# Altium project ArduinoMega2560.PrjPcb
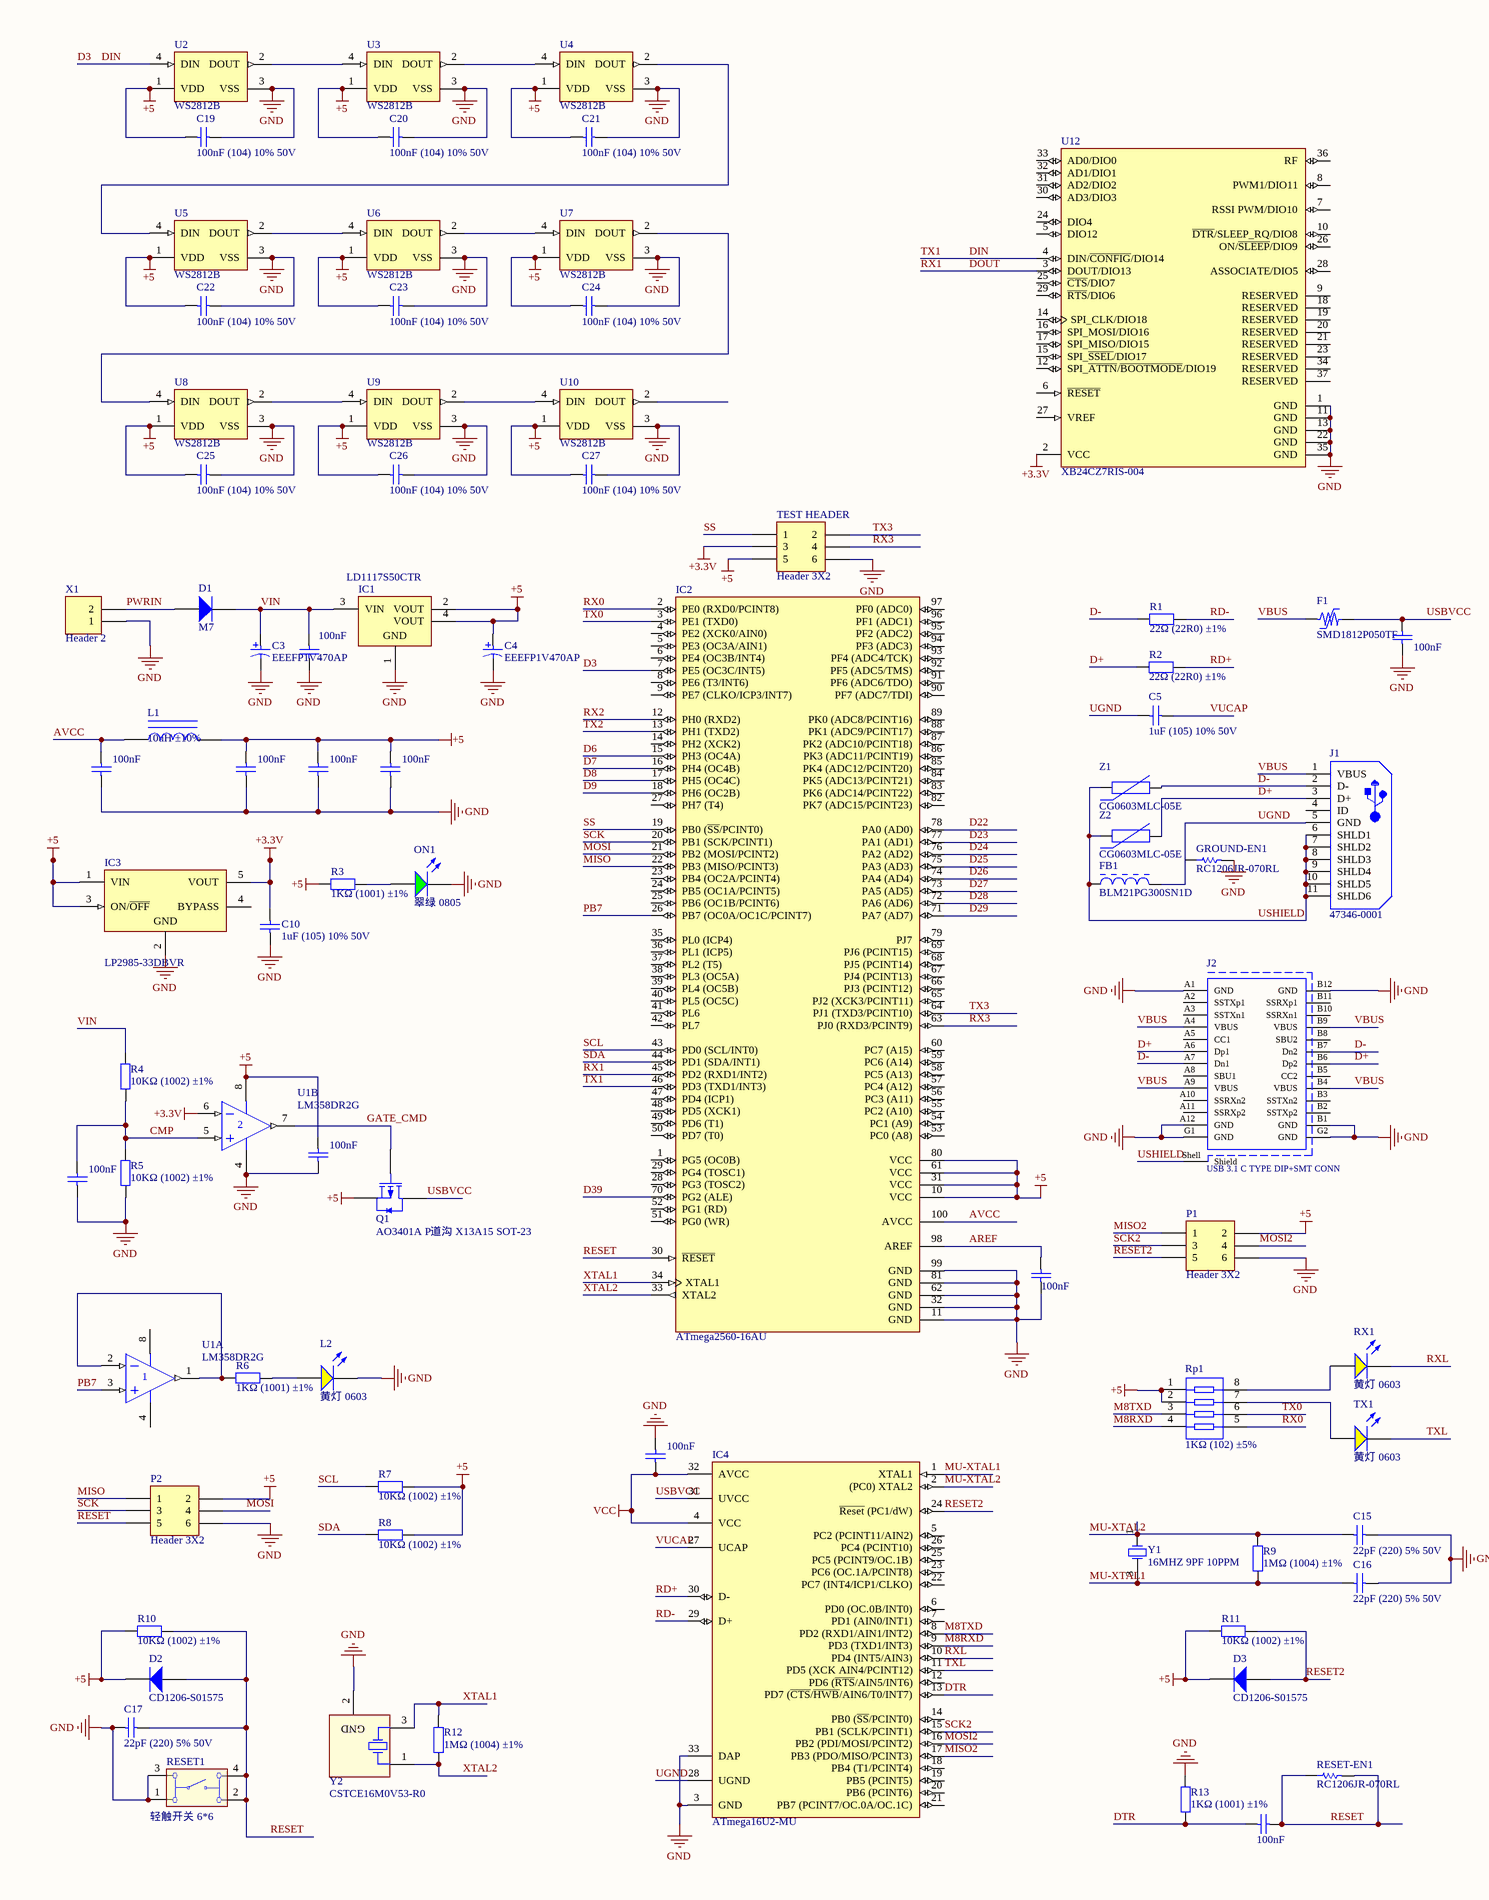
[diagram p0: ArduinoMega2560.SchDoc, left]
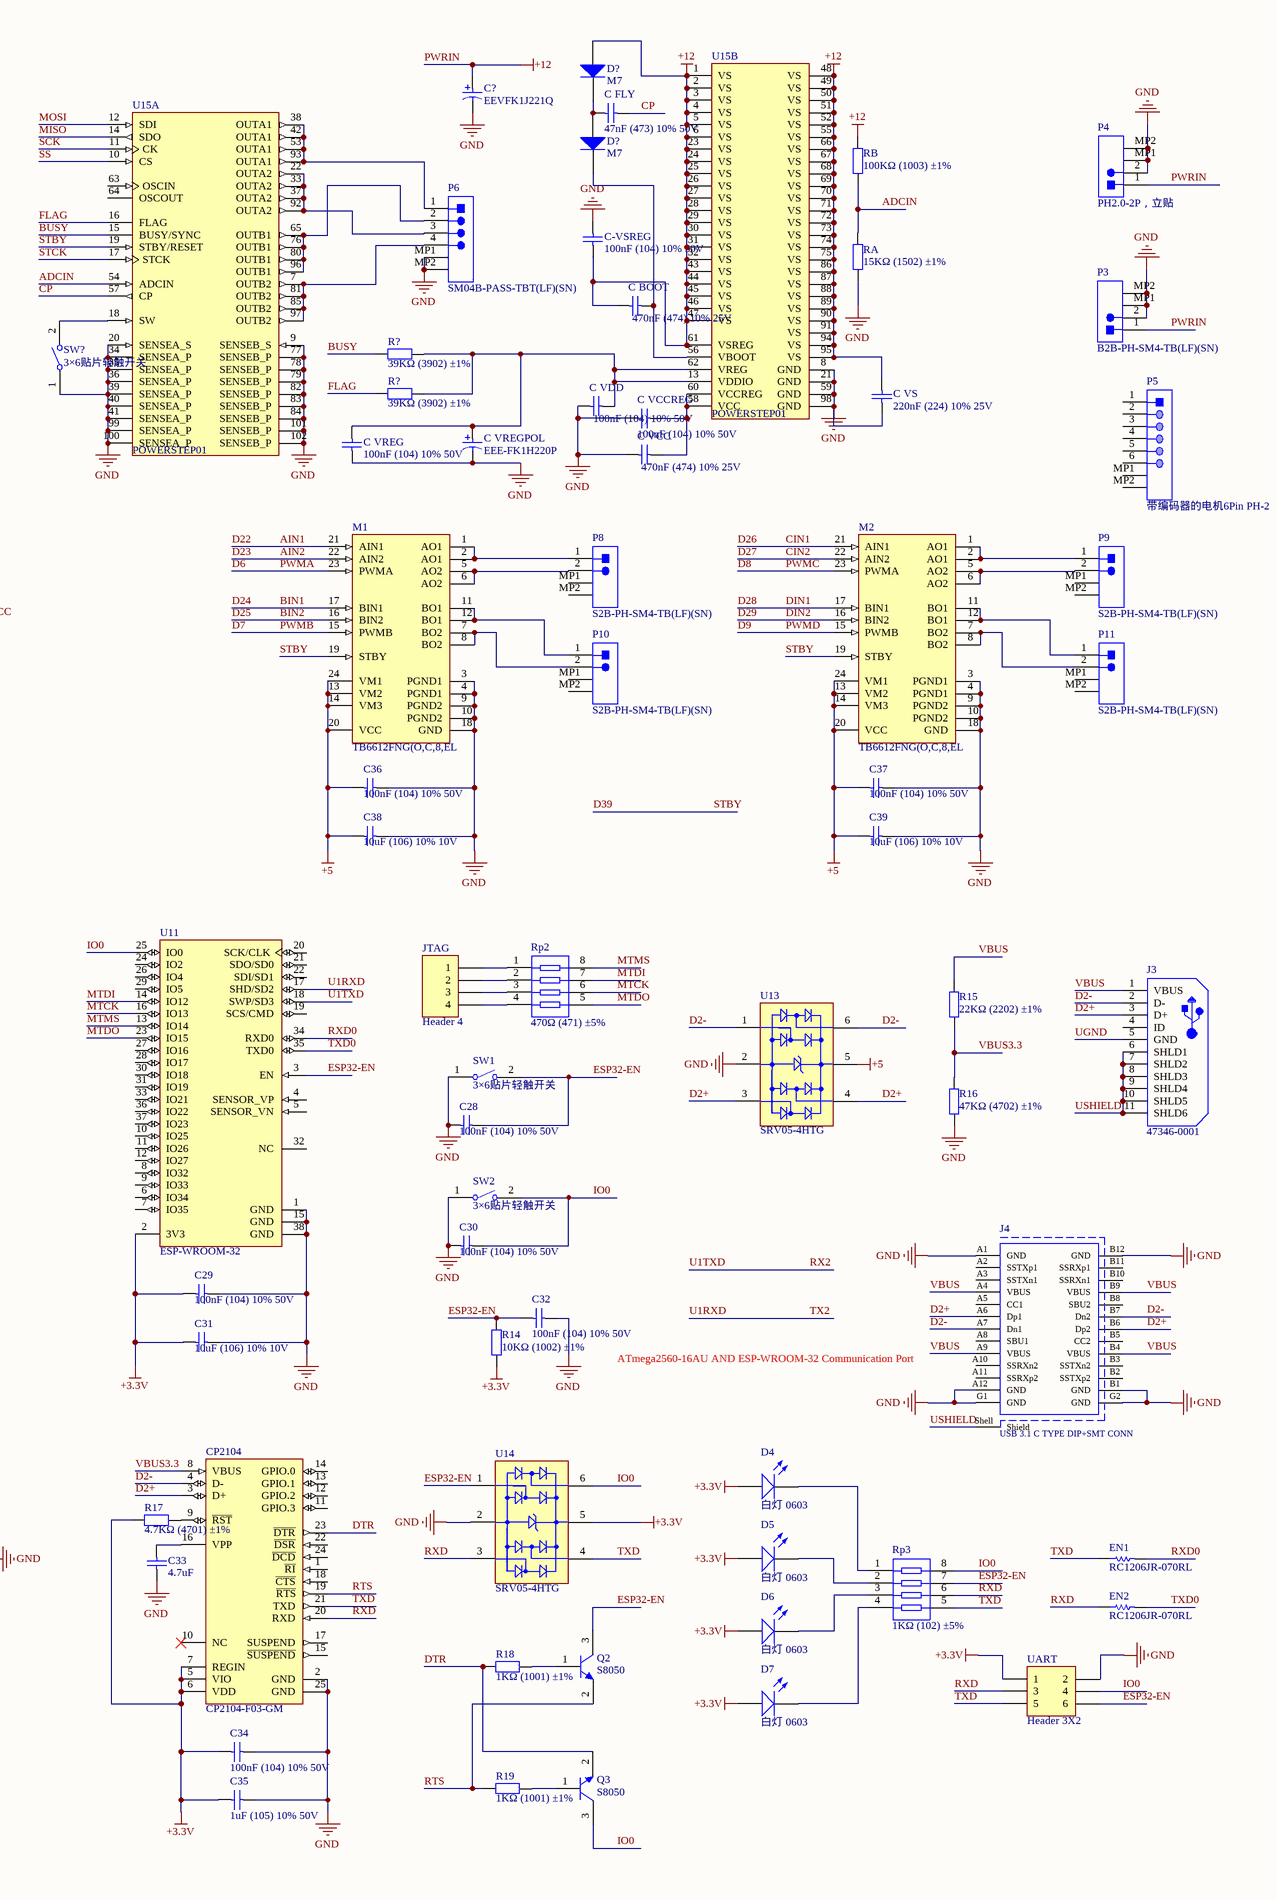
[diagram p1: ArduinoMega2560.SchDoc, right]
1 sheet, 146 parts. Net scope: global (net labels, ports and power ports of the same name join across sheets).
Board file: ArduinoMega2560.PcbDoc

## Sheet ArduinoMega2560.SchDoc
size A2

### Parts
(Parts that share a designator on the sheet are numbered #1, #2 ... from top to bottom, then left to right.)
C1  100nF  [0603_C]
C2  100nF  [0603_C]
C3  EEEFP1V470AP  [PNSC-FP-V-D_V]
C4  EEEFP1V470AP  [PNSC-FP-V-D_V]
C5  1uF (105) 10% 50V  [0603_C]
C6  100nF  [0603_C]
C7  100nF  [0603_C]
C8  100nF  [0603_C]
C9  100nF  [0603_C]
C10  1uF (105) 10% 50V  [0603_C]
C11  100nF  [0603_C]
C12  100nF  [0603_C]
C13  100nF  [0603_C]
C14  100nF  [0603_C]
C15  22pF (220) 5% 50V  [0603_C]
C16  22pF (220) 5% 50V  [0603_C]
C17  22pF (220) 5% 50V  [0603_C]
C18  100nF  [0603_C]
C19  100nF (104) 10% 50V  [0603_C]
C20  100nF (104) 10% 50V  [0603_C]
C21  100nF (104) 10% 50V  [0603_C]
C22  100nF (104) 10% 50V  [0603_C]
C23  100nF (104) 10% 50V  [0603_C]
C24  100nF (104) 10% 50V  [0603_C]
C25  100nF (104) 10% 50V  [0603_C]
C26  100nF (104) 10% 50V  [0603_C]
C27  100nF (104) 10% 50V  [0603_C]
C28  100nF (104) 10% 50V  [0603_C]
C29  100nF (104) 10% 50V  [0603_C]
C30  100nF (104) 10% 50V  [0603_C]
C31  10uF (106) 10% 10V  [0603_C]
C32  100nF (104) 10% 50V  [0603_C]
C33  4.7uF  [0603_C]
C34  100nF (104) 10% 50V  [0603_C]
C35  1uF (105) 10% 50V  [0603_C]
C36  100nF (104) 10% 50V  [0603_C]
C37  100nF (104) 10% 50V  [0603_C]
C38  10uF (106) 10% 10V  [0603_C]
C39  10uF (106) 10% 10V  [0603_C]
C-VSREG  100nF (104) 10% 50V  [0603_C]
C?  EEVFK1J221Q  [PNSC-FK-V-H13_V]
C_BOOT  470nF (474) 10% 25V  [0603_C]
C_FLY  47nF (473) 10% 50V  [0603_C]
C_VCC  470nF (474) 10% 25V  [0603_C]
C_VCCREG  100nF (104) 10% 50V  [0603_C]
C_VDD  100nF (104) 10% 50V  [0603_C]
C_VREG  100nF (104) 10% 50V  [0603_C]
C_VREGPOL  EEE-FK1H220P  [PNSC-EEE-FK1H220P_L]
C_VS  220nF (224) 10% 25V  [0603_C]
CP2104  CP2104-F03-GM  [SLAB-QFN-24-2675x2675TP_M]
D1  M7  [SMA(DO-214AC)_S1]
D2  CD1206-S01575  [BOUR-CD1206-S01575-2_L]
D3  CD1206-S01575  [BOUR-CD1206-S01575-2_L]
D4  白灯 0603  [0603_LED_S1]
D5  白灯 0603  [0603_LED_S1]
D6  白灯 0603  [0603_LED_S1]
D7  白灯 0603  [0603_LED_S1]
D?#1  M7  [SMA(DO-214AC)_S1]
D?#2  M7  [SMA(DO-214AC)_S1]
EN1  RC1206JR-070RL  [RESC3116X65X40ML10T20]
EN2  RC1206JR-070RL  [RESC3116X65X40ML10T20]
F1  SMD1812P050TF  [BOUR-MF-MSMF050-2_V]
FB1  BLM21PG300SN1D  [MURA-BLM21-B40-CHIP-2_V2]
GROUND-EN1  RC1206JR-070RL  [RESC3116X65X40ML10T20]
IC1  LD1117S50CTR  [SOT-223_N]
IC2  ATmega2560-16AU  [100A_M]
IC3  LP2985-33DBVR  [DBV0005A_M]
IC4  ATmega16U2-MU  [32PG_N]
J1  47346-0001  [MOLX-47346-0001-5_V]
J2  USB 3.1 C TYPE DIP+SMT CONN  [632723100011]
J3  47346-0001  [MOLX-47346-0001-5_V]
J4  USB 3.1 C TYPE DIP+SMT CONN  [632723100011]
JTAG  Header 4  [HDR1X4]
L1  10uH ±10%  [0603_L]
L2  黄灯 0603  [0603_LED_S1]
M1  TB6612FNG(O,C,8,EL  [TOSH-SSOP24-P-300-0.65A_M]
M2  TB6612FNG(O,C,8,EL  [TOSH-SSOP24-P-300-0.65A_M]
ON1  翠绿 0805  [0805_LED_S1]
P1  Header 3X2  [HDR2X3]
P2  Header 3X2  [HDR2X3]
P3  B2B-PH-SM4-TB(LF)(SN)  [JST-B2B-PH-SM4-TB-2_V]
P4  PH2.0-2P，立贴  [JST-B2B-PH-SM4-TB-2_V]
P5  带编码器的电机6Pin PH-2  [JST-S6B-PH-SM4-TB(LF)(SN)_V]
P6  SM04B-PASS-TBT(LF)(SN)  [JST-SM04B-PASS-TBT(LF)(SN)_V]
P8  S2B-PH-SM4-TB(LF)(SN)  [JST- S2B-PH-SM4-TB(LF)(SN)-2_V]
P9  S2B-PH-SM4-TB(LF)(SN)  [JST- S2B-PH-SM4-TB(LF)(SN)-2_V]
P10  S2B-PH-SM4-TB(LF)(SN)  [JST- S2B-PH-SM4-TB(LF)(SN)-2_V]
P11  S2B-PH-SM4-TB(LF)(SN)  [JST- S2B-PH-SM4-TB(LF)(SN)-2_V]
Q1  AO3401A P道沟 X13A15 SOT-23  [SOT-23-3L]
Q2  S8050  [ONSC-SOT-23-3-318-08_V]
Q3  S8050  [ONSC-SOT-23-3-318-08_V]
R1  22Ω (22R0) ±1%  [0603_R]
R2  22Ω (22R0) ±1%  [0603_R]
R3  1KΩ (1001) ±1%  [0603_R]
R4  10KΩ (1002) ±1%  [0603_R]
R5  10KΩ (1002) ±1%  [0603_R]
R6  1KΩ (1001) ±1%  [0603_R]
R7  10KΩ (1002) ±1%  [0603_R]
R8  10KΩ (1002) ±1%  [0603_R]
R9  1MΩ (1004) ±1%  [0603_R]
R10  10KΩ (1002) ±1%  [0603_R]
R11  10KΩ (1002) ±1%  [0603_R]
R12  1MΩ (1004) ±1%  [0603_R]
R13  1KΩ (1001) ±1%  [0603_R]
R14  10KΩ (1002) ±1%  [0603_R]
R15  22KΩ (2202) ±1%  [0603_R]
R16  47KΩ (4702) ±1%  [0603_R]
R17  4.7KΩ (4701) ±1%  [0603_R]
R18  1KΩ (1001) ±1%  [0603_R]
R19  1KΩ (1001) ±1%  [0603_R]
R?#1  39KΩ (3902) ±1%  [0603_R]
R?#2  39KΩ (3902) ±1%  [0603_R]
RA  15KΩ (1502) ±1%  [0603_R]
RB  100KΩ (1003) ±1%  [0603_R]
RESET1  轻触开关 6*6  [430152043836]
RESET-EN1  RC1206JR-070RL  [RESC3116X65X40ML10T20]
Rp1  1KΩ (102) ±5%  [0603_Rx4]
Rp2  470Ω (471) ±5%  [0603_Rx4]
Rp3  1KΩ (102) ±5%  [0603_Rx4]
RX1  黄灯 0603  [0603_LED_S1]
SW1  3×6贴片轻触开关  [TECO-FSMSM-2_V]
SW2  3×6贴片轻触开关  [TECO-FSMSM-2_V]
SW?  3×6贴片轻触开关  [TECO-FSMSM-2_V]
TEST_HEADER  Header 3X2  [HDR2X3]
TX1  黄灯 0603  [0603_LED_S1]
U1  LM358DR2G  [SOIC-8_150mil]  (parts A,B of 2)
U2  WS2812B  [ADA-RGB-1655_V]
U3  WS2812B  [ADA-RGB-1655_V]
U4  WS2812B  [ADA-RGB-1655_V]
U5  WS2812B  [ADA-RGB-1655_V]
U6  WS2812B  [ADA-RGB-1655_V]
U7  WS2812B  [ADA-RGB-1655_V]
U8  WS2812B  [ADA-RGB-1655_V]
U9  WS2812B  [ADA-RGB-1655_V]
U10  WS2812B  [ADA-RGB-1655_V]
U11  ESP-WROOM-32  [OLMX-ESP-WROOM-32]
U12  XB24CZ7RIS-004  [DIGI-XB24CZ7RIS-004-Module-37_V]
U13  SRV05-4HTG  [LFUS-SOT23-6_V]
U14  SRV05-4HTG  [LFUS-SOT23-6_V]
U15  POWERSTEP01  [STM-VFQFPN-102_V]  (parts A,B of 2)
UART  Header 3X2  [HDR2X3]
X1  Header 2  [HDR1X2]
Y1  16MHZ 9PF 10PPM  [SMD-3225_4P]
Y2  CSTCE16M0V53-R0  [MURA-CSTCE_V-3_V]
Z1  CG0603MLC-05E  [BOUR-CG0603-2_V]
Z2  CG0603MLC-05E  [BOUR-CG0603-2_V]

### Nets
+3.3V: C10.2 C29.1 C31.1 C34.1 C35.1 CP2104.5(VIO) CP2104.6(VDD) CP2104.7(REGIN) D4.A D5.A D6.A D7.A IC3.5(VOUT) R14.1 R17.2 TEST_HEADER.3 U1.6(IN-) U11.2(3V3) U12.2(VCC) U14.5(VCC) UART.1
+5: C4.1 C7.1 C8.1 C9.1 C11.1 C19.1 C20.1 C21.1 C22.1 C23.1 C24.1 C25.1 C26.1 C27.1 C36.1 C37.1 C38.1 C39.1 D2.2(K) D3.2(K) IC1.2(VOUT) IC1.4(VOUT) IC2.10(VCC) IC2.31(VCC) IC2.61(VCC) IC2.80(VCC) IC3.1(VIN) IC3.3(ON/~{OFF}) L1.2 M1.13(VM2) M1.14(VM3) M1.20(VCC) M1.24(VM1) M2.13(VM2) M2.14(VM3) M2.20(VCC) M2.24(VM1) P1.2 P2.2 Q1.2(S) R3.1 R7.1 R8.1 R10.2 R11.2 Rp1.1 Rp1.2 TEST_HEADER.5 U1.8(V+) U2.1(VDD) U3.1(VDD) U4.1(VDD) U5.1(VDD) U6.1(VDD) U7.1(VDD) U8.1(VDD) U9.1(VDD) U10.1(VDD) U13.5(VCC)
GND: C1.1 C2.2 C3.2 C4.2 C6.2 C7.2 C8.2 C9.2 C10.1 C11.2 C12.2 C13.2 C14.1 C15.1 C16.2 C17.1 C19.2 C20.2 C21.2 C22.2 C23.2 C24.2 C25.2 C26.2 C27.2 C28.1 C29.2 C30.1 C31.2 C32.2 C33.1 C34.2 C35.2 C36.2 C37.2 C38.2 C39.2 C-VSREG.2 C?.2 C_VCC.1 C_VCCREG.1 C_VDD.1 C_VREG.1 C_VREGPOL.2 C_VS.1 CP2104.2(GND) CP2104.25(GND) GROUND-EN1.2 IC1.1(GND) IC2.11(GND) IC2.32(GND) IC2.62(GND) IC2.81(GND) IC2.99(GND) IC3.2(GND) IC4.3(GND) IC4.33(DAP) J2.A1(GND) J2.A12(GND) J2.B1(GND) J2.B12(GND) J2.G1(GND) J2.G2(GND) J4.A1(GND) J4.A12(GND) J4.B1(GND) J4.B12(GND) J4.G1(GND) J4.G2(GND) L2.K M1.3(PGND1) M1.4(PGND1) M1.9(PGND2) M1.10(PGND2) M1.18(GND) M2.3(PGND1) M2.4(PGND1) M2.9(PGND2) M2.10(PGND2) M2.18(GND) ON1.K P1.6 P2.6 P3.2 P3.MP1 P3.MP2 P4.2 P4.MP1 P4.MP2 P6.MP1 P6.MP2 R5.1 R13.1 R16.1 RA.1 RESET1.1 RESET1.3 SW1.1 SW2.1 SW?.1 TEST_HEADER.6 U1.4(V-) U2.3(VSS) U3.3(VSS) U4.3(VSS) U5.3(VSS) U6.3(VSS) U7.3(VSS) U8.3(VSS) U9.3(VSS) U10.3(VSS) U11.1(GND) U11.15(GND) U11.38(GND) U12.1(GND) U12.11(GND) U12.13(GND) U12.22(GND) U12.35(GND) U13.2(GND) U14.2(GND) U15.8(GND) U15.9(SENSEB_S) U15.20(SENSEA_S) U15.21(GND) U15.34(SENSEA_P) U15.35(SENSEA_P) U15.36(SENSEA_P) U15.39(SENSEA_P) U15.40(SENSEA_P) U15.41(SENSEA_P) U15.59(GND) U15.77(SENSEB_P) U15.78(SENSEB_P) U15.79(SENSEB_P) U15.82(SENSEB_P) U15.83(SENSEB_P) U15.84(SENSEB_P) U15.98(GND) U15.99(SENSEA_P) U15.100(SENSEA_P) U15.101(SENSEB_P) U15.102(SENSEB_P) UART.2 X1.1 Y2.2(GND)
PWRIN: C-VSREG.1 C?.1 C_BOOT.1 C_VS.2 D1.1(A) D?#1.1(A) P3.1 P4.1 RB.2 U15.1(VS) U15.2(VS) U15.3(VS) U15.4(VS) U15.5(VS) U15.6(VS) U15.23(VS) U15.24(VS) U15.25(VS) U15.26(VS) U15.27(VS) U15.28(VS) U15.29(VS) U15.30(VS) U15.31(VS) U15.32(VS) U15.43(VS) U15.44(VS) U15.45(VS) U15.46(VS) U15.47(VS) U15.48(VS) U15.49(VS) U15.50(VS) U15.51(VS) U15.52(VS) U15.55(VS) U15.61(VSREG) U15.66(VS) U15.67(VS) U15.68(VS) U15.69(VS) U15.70(VS) U15.71(VS) U15.72(VS) U15.73(VS) U15.74(VS) U15.75(VS) U15.86(VS) U15.87(VS) U15.88(VS) U15.89(VS) U15.90(VS) U15.91(VS) U15.94(VS) U15.95(VS) X1.2  [also labelled +12]
VCC: C14.2 IC4.4(VCC) IC4.32(AVCC)
ADCIN: RA.2 RB.1 U15.54(ADCIN)
AIN1: IC2.78(PA0_(AD0)) M1.21(AIN1)  [also labelled D22]
AIN2: IC2.77(PA1_(AD1)) M1.22(AIN2)  [also labelled D23]
AREF: C13.1 IC2.98(AREF)
AVCC: C6.1 IC2.100(AVCC) L1.1
BIN1: IC2.76(PA2_(AD2)) M1.17(BIN1)  [also labelled D24]
BIN2: IC2.75(PA3_(AD3)) M1.16(BIN2)  [also labelled D25]
BUSY: R?#1.1 U15.15(BUSY/SYNC)
CIN1: IC2.74(PA4_(AD4)) M2.21(AIN1)  [also labelled D26]
CIN2: IC2.73(PA5_(AD5)) M2.22(AIN2)  [also labelled D27]
CMP: C12.1 R4.1 R5.2 U1.5(IN+)
CP: C_FLY.2 U15.57(CP)
D2+: CP2104.3(D+) J3.3(D+) J4.A6(Dp1) J4.B6(Dp2) U13.3(I/O_2) U13.4(I/O_3)
D2-: CP2104.4(D-) J3.2(D-) J4.A7(Dn1) J4.B7(Dn2) U13.1(I/O_1) U13.6(I/O_4)
D3: IC2.7(PE5_(OC3C/INT5)) IC2.46(PD3_(TXD1/INT3)) U2.4(DIN) U12.4(DIN/~{CONFIG}/DIO14)  [also labelled DIN, TX1]
D6: IC2.15(PH3_(OC4A)) M1.23(PWMA)  [also labelled PWMA]
D7: IC2.16(PH4_(OC4B)) M1.15(PWMB)  [also labelled PWMB]
D8: IC2.17(PH5_(OC4C)) M2.23(PWMA)  [also labelled PWMC]
D9: IC2.18(PH6_(OC2B)) M2.15(PWMB)  [also labelled PWMD]
D28: IC2.72(PA6_(AD6)) M2.17(BIN1)  [also labelled DIN1]
D29: IC2.71(PA7_(AD7)) M2.16(BIN2)  [also labelled DIN2]
D39: IC2.70(PG2_(ALE)) M1.19(STBY) M2.19(STBY) U15.19(STBY/RESET)  [also labelled STBY]
D+: J1.3(D+) J2.A6(Dp1) J2.B6(Dp2) R2.1 Z2.2
D-: J1.2(D-) J2.A7(Dn1) J2.B7(Dn2) R1.1 Z1.2
DOUT: IC2.45(PD2_(RXD1/INT2)) U12.3(DOUT/DIO13)  [also labelled RX1]
DTR: C18.1 CP2104.23(~{DTR}) IC4.13(PD7_(~{CTS}/~{HWB}/AIN6/T0/INT7)) Q3.2(E) R13.2 R18.1
ESP32-EN: C28.2 C32.1 Q2.3(C) R14.2 Rp3.7 SW1.2 U11.3(EN) U14.1(I/O_1) UART.6
FLAG: R?#2.1 U15.16(FLAG)
GATE_CMD: Q1.1(G) U1.7(OUT)
IO0: C30.2 Q3.3(C) Rp3.8 SW2.2 U11.25(IO0) U14.6(I/O_4) UART.4
M8RXD: IC4.9(PD3_(TXD1/INT3)) Rp1.4
M8TXD: IC4.8(PD2_(RXD1/AIN1/INT2)) Rp1.3
MISO: IC2.22(PB3_(MISO/PCINT3)) P2.1 U15.14(SDO)
MISO2: IC4.17(PB3_(PDO/MISO/PCINT3)) P1.1
MOSI: IC2.21(PB2_(MOSI/PCINT2)) P2.4 U15.12(SDI)
MOSI2: IC4.16(PB2_(PDI/MOSI/PCINT2)) P1.4
MTCK: Rp2.6 U11.16(IO13)
MTDI: Rp2.7 U11.14(IO12)
MTDO: Rp2.5 U11.23(IO15)
MTMS: Rp2.8 U11.13(IO14)
MU-XTAL1: C16.1 IC4.1(XTAL1) R9.2 Y1.3(OSC2)
MU-XTAL2: C15.2 IC4.2((PC0)_XTAL2) R9.1 Y1.1(OSC1)
PB7: IC2.26(PB7_(OC0A/OC1C/PCINT7)) U1.3(IN+)
RD+: IC4.30(D-) R2.2
RD-: IC4.29(D+) R1.2
RESET: C17.2 C18.2 D2.1(A) IC2.30(~{RESET}) P2.5 R10.1 RESET1.2 RESET1.4 RESET-EN1.1 RESET-EN1.2
RESET2: D3.1(A) IC4.24(~{Reset}_(PC1/dW)) P1.5 R11.1
RTS: CP2104.19(~{RTS}) Q2.2(E) R19.1
RX0: IC2.2(PE0_(RXD0/PCINT8)) Rp1.5
RX2: IC2.12(PH0_(RXD2)) U11.18(SWP/SD3)  [also labelled U1TXD]
RX3: IC2.63(PJ0_(RXD3/PCINT9)) TEST_HEADER.4
RXD: CP2104.20(RXD) EN2.1 Rp3.6 U14.3(I/O_2) UART.3
RXD0: EN1.2 U11.34(RXD0)
RXL: IC4.10(PD4_(INT5/AIN3)) RX1.K
SCK: IC2.20(PB1_(SCK/PCINT1)) P2.3 U15.11(CK)
SCK2: IC4.15(PB1_(SCLK/PCINT1)) P1.3
SCL: IC2.43(PD0_(SCL/INT0)) R7.2
SDA: IC2.44(PD1_(SDA/INT1)) R8.2
SS: IC2.19(PB0_(~{SS}/PCINT0)) TEST_HEADER.1 U15.10(CS)
STCK: U15.17(STCK)
TX0: IC2.3(PE1_(TXD0)) Rp1.6
TX2: IC2.13(PH1_(TXD2)) U11.17(SHD/SD2)  [also labelled U1RXD]
TX3: IC2.64(PJ1_(TXD3/PCINT10)) TEST_HEADER.2
TXD: CP2104.21(TXD) EN1.1 Rp3.5 U14.4(I/O_3) UART.5
TXD0: EN2.2 U11.35(TXD0)
TXL: IC4.11(PD5_(XCK_AIN4/PCINT12)) TX1.K
UGND: C5.2 FB1.2 IC4.28(UGND) J1.5(GND) J3.5(GND)
USBVCC: C1.2 F1.2 IC4.31(UVCC) Q1.3(D)
USHIELD: FB1.1 J1.6(SHLD1) J1.7(SHLD2) J1.8(SHLD3) J1.9(SHLD4) J1.10(SHLD5) J1.11(SHLD6) J2.Shell(Shield) J3.6(SHLD1) J3.7(SHLD2) J3.8(SHLD3) J3.9(SHLD4) J3.10(SHLD5) J3.11(SHLD6) J4.Shell(Shield) Z1.1 Z2.1
VBUS: F1.1 J1.1(VBUS) J2.A4(VBUS) J2.A9(VBUS) J2.B4(VBUS) J2.B9(VBUS) J3.1(VBUS) J4.A4(VBUS) J4.A9(VBUS) J4.B4(VBUS) J4.B9(VBUS) R15.2
VBUS3.3: CP2104.8(VBUS) R15.1 R16.2
VIN: C2.1 C3.1 D1.2(K) IC1.3(VIN) R4.2
VUCAP: C5.1 IC4.27(UCAP)
XTAL1: IC2.34(XTAL1) R12.2 Y2.3(C2)
XTAL2: IC2.33(XTAL2) R12.1 Y2.1(C1)
NetC33_2: C33.2 CP2104.16(VPP)
NetC_BOOT_2: C_BOOT.2 D?#2.2(K) U15.56(VBOOT)
NetC_FLY_1: C_FLY.1 D?#1.2(K) D?#2.1(A)
NetC_VCC_2: C_VCC.2 C_VCCREG.2 U15.58(VCC) U15.60(VCCREG)
NetC_VDD_2: C_VDD.2 C_VREG.2 C_VREGPOL.1 R?#1.2 R?#2.2 U15.13(VDDIO) U15.62(VREG)
NetCP2104_9: CP2104.9(~{RST}) R17.1
NetD4_K: D4.K Rp3.1
NetD5_K: D5.K Rp3.2
NetD6_K: D6.K Rp3.3
NetD7_K: D7.K Rp3.4
NetJTAG_1: JTAG.1 Rp2.1
NetJTAG_2: JTAG.2 Rp2.2
NetJTAG_3: JTAG.3 Rp2.3
NetJTAG_4: JTAG.4 Rp2.4
NetL2_A: L2.A R6.2
NetM1_1: M1.1(AO1) M1.2(AO1) P8.1
NetM1_5: M1.5(AO2) M1.6(AO2) P8.2
NetM1_7: M1.7(BO2) M1.8(BO2) P10.2
NetM1_11: M1.11(BO1) M1.12(BO1) P10.1
NetM2_1: M2.1(AO1) M2.2(AO1) P9.1
NetM2_5: M2.5(AO2) M2.6(AO2) P9.2
NetM2_7: M2.7(BO2) M2.8(BO2) P11.2
NetM2_11: M2.11(BO1) M2.12(BO1) P11.1
NetON1_A: ON1.A R3.2
NetP6_1: P6.1 U15.38(OUTA1) U15.42(OUTA1) U15.53(OUTA1) U15.93(OUTA1)
NetP6_2: P6.2 U15.65(OUTB1) U15.76(OUTB1) U15.80(OUTB1) U15.96(OUTB1)
NetP6_3: P6.3 U15.22(OUTA2) U15.33(OUTA2) U15.37(OUTA2) U15.92(OUTA2)
NetP6_4: P6.4 U15.7(OUTB2) U15.81(OUTB2) U15.85(OUTB2) U15.97(OUTB2)
NetQ2_1: Q2.1(B) R18.2
NetQ3_1: Q3.1(B) R19.2
NetR6_1: R6.1 U1.1(OUT) U1.2(IN-)
NetRp1_7: Rp1.7 TX1.A
NetRp1_8: Rp1.8 RX1.A
NetSW?_2: SW?.2 U15.18(SW)
NetU2_2: U2.2(DOUT) U3.4(DIN)
NetU3_2: U3.2(DOUT) U4.4(DIN)
NetU4_2: U4.2(DOUT) U5.4(DIN)
NetU5_2: U5.2(DOUT) U6.4(DIN)
NetU6_2: U6.2(DOUT) U7.4(DIN)
NetU7_2: U7.2(DOUT) U8.4(DIN)
NetU8_2: U8.2(DOUT) U9.4(DIN)
NetU9_2: U9.2(DOUT) U10.4(DIN)

Not connected (* = marked no-connect by the designer): CP2104 1(~{RI}) 10(NC)* 11(GPIO.3) 12(GPIO.2) 13(GPIO.1) 14(GPIO.0) 15(~{SUSPEND}) 17(SUSPEND) 18(~{CTS}) 22(~{DSR}) 24(~{DCD}); GROUND-EN1 1; IC2 1(PG5_(OC0B)) 4(PE2_(XCK0/AIN0)) 5(PE3_(OC3A/AIN1)) 6(PE4_(OC3B/INT4)) 8(PE6_(T3/INT6)) 9(PE7_(CLKO/ICP3/INT7)) 14(PH2_(XCK2)) 23(PB4_(OC2A/PCINT4)) 24(PB5_(OC1A/PCINT5)) 25(PB6_(OC1B/PCINT6)) 27(PH7_(T4)) 28(PG3_(TOSC2)) 29(PG4_(TOSC1)) 35(PL0_(ICP4)) 36(PL1_(ICP5)) 37(PL2_(T5)) 38(PL3_(OC5A)) 39(PL4_(OC5B)) 40(PL5_(OC5C)) 41(PL6) 42(PL7) 47(PD4_(ICP1)) 48(PD5_(XCK1)) 49(PD6_(T1)) 50(PD7_(T0)) 51(PG0_(WR)) 52(PG1_(RD)) 53(PC0_(A8)) 54(PC1_(A9)) 55(PC2_(A10)) 56(PC3_(A11)) 57(PC4_(A12)) 58(PC5_(A13)) 59(PC6_(A14)) 60(PC7_(A15)) 65(PJ2_(XCK3/PCINT11)) 66(PJ3_(PCINT12)) 67(PJ4_(PCINT13)) 68(PJ5_(PCINT14)) 69(PJ6_(PCINT15)) 79(PJ7) 82(PK7_(ADC15/PCINT23)) 83(PK6_(ADC14/PCINT22)) 84(PK5_(ADC13/PCINT21)) 85(PK4_(ADC12/PCINT20)) 86(PK3_(ADC11/PCINT19)) 87(PK2_(ADC10/PCINT18)) 88(PK1_(ADC9/PCINT17)) 89(PK0_(ADC8/PCINT16)) 90(PF7_(ADC7/TDI)) 91(PF6_(ADC6/TDO)) 92(PF5_(ADC5/TMS)) 93(PF4_(ADC4/TCK)) 94(PF3_(ADC3)) 95(PF2_(ADC2)) 96(PF1_(ADC1)) 97(PF0_(ADC0)); IC3 4(BYPASS); IC4 5(PC2_(PCINT11/AIN2)) 6(PD0_(OC.0B/INT0)) 7(PD1_(AIN0/INT1)) 12(PD6_(~{RTS}/AIN5/INT6)) 14(PB0_(~{SS}/PCINT0)) 18(PB4_(T1/PCINT4)) 19(PB5_(PCINT5)) 20(PB6_(PCINT6)) 21(PB7_(PCINT7/OC.0A/OC.1C)) 22(PC7_(INT4/ICP1/CLKO)) 23(PC6_(OC.1A/PCINT8)) 25(PC5_(PCINT9/OC.1B)) 26(PC4_(PCINT10)); J1 4(ID); J2 A2(SSTXp1) A3(SSTXn1) A5(CC1) A8(SBU1) A10(SSRXn2) A11(SSRXp2) B2(SSTXp2) B3(SSTXn2) B5(CC2) B8(SBU2) B10(SSRXn1) B11(SSRXp1); J3 4(ID); J4 A2(SSTXp1) A3(SSTXn1) A5(CC1) A8(SBU1) A10(SSRXn2) A11(SSRXp2) B2(SSTXp2) B3(SSTXn2) B5(CC2) B8(SBU2) B10(SSRXn1) B11(SSRXp1); P5 1 2 3 4 5 6 MP1 MP2; P8 MP1 MP2; P9 MP1 MP2; P10 MP1 MP2; P11 MP1 MP2; U10 2(DOUT); U11 4(SENSOR_VP) 5(SENSOR_VN) 6(IO34) 7(IO35) 8(IO32) 9(IO33) 10(IO25) 11(IO26) 12(IO27) 19(SCS/CMD) 20(SCK/CLK) 21(SDO/SD0) 22(SDI/SD1) 24(IO2) 26(IO4) 27(IO16) 28(IO17) 29(IO5) 30(IO18) 31(IO19) 32(NC) 33(IO21) 36(IO22) 37(IO23); U12 5(DIO12) 6(~{RESET}) 7(RSSI_PWM/DIO10) 8(PWM1/DIO11) 9(RESERVED) 10(~{DTR}/SLEEP_RQ/DIO8) 12(SPI_~{ATTN}/~{BOOTMODE}/DIO19) 14(SPI_CLK/DIO18) 15(SPI_~{SSEL}/DIO17) 16(SPI_MOSI/DIO16) 17(SPI_MISO/DIO15) 18(RESERVED) 19(RESERVED) 20(RESERVED) 21(RESERVED) 23(RESERVED) 24(DIO4) 25(~{CTS}/DIO7) 26(ON/~{SLEEP}/DIO9) 27(VREF) 28(ASSOCIATE/DIO5) 29(~{RTS}/DIO6) 30(AD3/DIO3) 31(AD2/DIO2) 32(AD1/DIO1) 33(AD0/DIO0) 34(RESERVED) 36(RF) 37(RESERVED); U15 63(OSCIN) 64(OSCOUT)

### Notes on the sheet
- ATmega2560-16AU AND ESP-WROOM-32 Communication Port

### Library data of the parts
C1 C2 C6-C9 C11-C14 C18-C30 C32 C34 C36 C37 C-VSREG C_VCCREG C_VDD C_VREG = 0603 100nF (104) 10% 50V: 贴片电容; ComponentLink1Description: 供应商链接; ComponentLink1URL: http://www.szlcsc.com/product/details_15331.html; Package: 0603; Supplier: LC; SuppliersPartNumber: C14663
C3 C4 = CMP-2000-06216-1: Aluminum Electrolytic Capacitor, 47 uF, +/- 20%, 35 V, 2-Pin SMD (Size Code D), -55 to 105 degC, RoHS, Tape and Reel; Manufacturer: Panasonic; Lifetime@Temperature: 2000Hrs@105°C; Capacitance: 47µF; Type: Can; Rated Voltage: 35V; Ripple Current: 300mA; ESR (Equivalent Series Resistance): 0.26O; Package Reference: FP-V-D; Package Description: 2-Pin Electrolytic Aluminum Capacitor, Body 6.6 x 6.6 mm; Datasheet URL: http://industrial.panasonic.com/cdbs/www-data/pdf/RDE0000/ABA0000C1184.pdf; Series: FP; Operating Temp Range: -55to+105°C; Operating Temp-Max: 105°C; Datasheet Version: 03/2016; Manufacturer URL: http://www.panasonic.com/; Package URL: http://industrial.panasonic.com/cdbs/www-data/pdf/RDE0000/DME0000COL48.pdf; Case Size/Dimension: Ø6.3x5.8mm; Mounting Technology: SurfaceMount
C5 C10 C35 = 0603 1uF (105) 10% 50V: 贴片电容; ComponentLink1Description: 供应商链接; ComponentLink1URL: http://www.szlcsc.com/product/details_16531.html; Package: 0603; Supplier: LC; SuppliersPartNumber: C15849
C15-C17 = 0603 22pF (220) 5% 50V: 贴片电容; ComponentLink1Description: 供应商链接; ComponentLink1URL: http://www.szlcsc.com/product/details_2005.html; Package: 0603; Supplier: LC; SuppliersPartNumber: C1653
C31 C38 C39 = 0603 10uF (106) 10% 10V: 贴片电容; ComponentLink1Description: 供应商链接; ComponentLink1URL: http://www.szlcsc.com/product/details_20411.html; Package: 0603; Supplier: LC; SuppliersPartNumber: C19702
C33 = 0603 4.7uF (475) 10% 16V: 贴片电容; ComponentLink1Description: 供应商链接; ComponentLink1URL: http://www.szlcsc.com/product/details_20375.html; Package: 0603; Supplier: LC; SuppliersPartNumber: C19666
C? = CMP-2000-06222-1: Aluminum Electrolytic Capacitor, 220 uF, +/- 20%, 63 V, 2-Pin SMD (Size Code H13), -55 to 105 degC, RoHS, Tape and Reel; Manufacturer: Panasonic; Impedance: 0.16ohm; Life Time @ Temperature: 2000hours@105°C; Product Range: PANASONIC-?????FK; Voltage Rating: 63V; External Length / Height: 13.5mm; Ripple Current Temperature: 105°C; Ripple Current Frequency: 100kHz; Ripple Current AC: 800mA; Power Factor: 0.08; Power Factor Frequency: 120Hz; AE Capacitor Case: RadialCan-SMD; Capacitance: 220µF; Operating Lifetime: 2000h; SVHC: NoSVHC(16-Dec-2013); Diameter: 12.5mm; Package Description: 2-Pin Electrolytic Aluminum Capacitor, Body 13.5 x 13.5 mm; Height: 13.5mm; Package URL: http://industrial.panasonic.com/cdbs/www-data/pdf/RDE0000/DME0000COL48.pdf; Lifetime @ Temperature: 2000hours@105°C; Series: FK; Mounting Technology: SurfaceMount; Datasheet Version: 03/2016; Package / Case: H13; Voltage Rating V DC: 63V; Capacitance Tolerance ±: ±20%; Tolerance +: 20%; Capacitance Tolerance: ±20%; Package Reference: FK-V-H13; Datasheet URL: https://industrial.panasonic.com/cdbs/www-data/pdf/RDE0000/ABA0000C1181.pdf; Operating Temperature Range: -55°Cto+105°C; Manufacturer URL: http://www.panasonic.com/; Operating Temperature Min: -55°C; Capacitor Terminals: SMD; Packaging: CutTape; Operating Temperature Max: 105°C; Tolerance -: 20%; Operating life Time: 2000h; Capacitor Case Style: SMD
C_BOOT C_VCC = 0603 470nF (474) 10% 25V: 贴片电容; ComponentLink1Description: 供应商链接; ComponentLink1URL: http://www.szlcsc.com/product/details_1975.html; Package: 0603; Supplier: LC; SuppliersPartNumber: C1623
C_FLY = 0603 47nF (473) 10% 50V: 贴片电容; ComponentLink1Description: 供应商链接; ComponentLink1URL: http://www.szlcsc.com/product/details_1974.html; Package: 0603; Supplier: LC; SuppliersPartNumber: C1622
C_VREGPOL = CMP-2000-06209-1: Cap Aluminum Lytic, 22 uF, +/- 20%, 6.3 to 100 V, -55 to 105 degC, 2-Pin SMD, RoHS, Tape and Reel; Manufacturer: Panasonic; Capacitance: 22µF; Rated Voltage: 50V; Lifetime@Temperature: 2000Hrs@105°C; Ripple Current: 165mA; Impedance: 0.88O; Operating Temp Range: -55to+105°C; Package Reference: EEE-FK1H220P; Case Size/Dimension: Ø6.3x5.8mm; Manufacturer URL: http://www.panasonic.com/; Datasheet URL: http://www.mouser.com/ds/2/315/ABA0000CE120-68386.pdf; Mounting Technology: SurfaceMount; Datasheet Version: 03/2014; Package Description: 2-Pin Aluminum Electrolytic Capacitor, Base 6.6 x 6.6 mm, Height 6.10 mm; Operating Temp-Max: 105°C; Series: FK; Type: Can
C_VS = 0603 220nF (224) 10% 25V: 贴片电容; ComponentLink1Description: 供应商链接; ComponentLink1URL: http://www.szlcsc.com/product/details_21832.html; Package: 0603; Supplier: LC; SuppliersPartNumber: C21120
CP2104 = CMP-0511-00004-1: Single-Chip USB to UART Bridge, 4 Dig I/O Pins, Internal Oscillator, 1024 Bytes EEPROM, -40 to 85 degC, 24-pin QFN; Manufacturer: Silicon Labs; Sub-Family: USB Bridges; Internal Oscillator: TRUE; Mounting Technology: Surface Mount; ComponentLink3URL: http://www.silabs.com/Support%20Documents/TechnicalDocs/C8051F93x-92x.pdf; DatasheetVersion: Rev. 1.0; ComponentLink1URL: http://www.silabs.com/; Code_IPC: J-STD-020; ComponentLink2URL: http://www.silabs.com/Support%20Documents/TechnicalDocs/cp2104.pdf; Code_JEDEC: MO-220; PackageReference: QFN-24; ComponentLink3Description: Package Specification; PartNumber: CP2104-F03-GM; ComponentLink1Description: Manufacturer URL; ComponentLink2Description: Datasheet; EEPROM: 1024 Bytes; PackageDescription: 24-Pin Quad-Flat No-Leads Package, Body 4 x 4 mm, Pitch 0.5 mm
D1 D?#1 D?#2 = SMA(DO-214AC) M7: 二极管; Notepad: 1N4007 4007 编号C2464 已经停售, 使用新物料编号C95872; ComponentLink1Description: 供应商链接; ComponentLink1URL: http://www.szlcsc.com/product/details_2841.html; Package: SMA(DO-214AC); Supplier: LC; SuppliersPartNumber: C95872
D2 D3 = CMP-0583-00001-2: 75 V Small Signal Switching Diode, 150 mA, 2.5 uA, 1026 Molded Package, RoHS, Tape and Reel; Manufacturer: Bourns; Reverse Voltage: 75 V; Average Forward Current: 150 mA; Reverse Current (Max.): 2.5 uA; Capacitance Between Terminals (Max.): 3 pF; Reverse Recovery Time (Max.): 4 nS; Forward Voltage (Max.): 1.00 V; Packing: Tape and Reel; Mounting Technology: Surface Mount; DatasheetVersion: Rev. 06/11; ComponentLink2URL: http://www.bourns.com/data/global/pdfs/CD1206_S01575.pdf; PackageReference: CD1206-S01575-2; RoHS: TRUE; ComponentLink1URL: http://www.bourns.com/; ComponentLink1Description: Manufacturer URL; ComponentLink3Description: Package Specification; ComponentLink3URL: http://www.bourns.com/data/global/pdfs/CD1206_S01575.pdf; ComponentLink2Description: Datasheet; PackageDescription: 2-Pin SMD, Body 3.2 x 1.5 mm; PartNumber: CD1206-S01575
D4-D7 = 0603 白灯: 发光二极管; ComponentLink1Description: 供应商链接; ComponentLink1URL: http://www.szlcsc.com/product/details_2663.html; Package: 0603; Supplier: LC; SuppliersPartNumber: C2290
EN1 EN2 GROUND-EN1 RESET-EN1 = CMP-2100-03681-1: Chip Resistor, 0 Ohm, +/- 5%, -55 to 155 degC, 1206 (3216 Metric), RoHS, Tape and Reel; Manufacturer: Yageo; Max Power Dissipation: 250mW; Resistance: 0mOhm; Voltage Rating: 200V; Temperature Coefficient: 200ppm/degreesC; Case Code (Imperial): 1206; Lead Free: LeadFree; Package Quantity: 5000; Radiation Hardening: No; Tolerance: 5%; Length: 3.1mm; Termination: SMD/SMT; Contact Plating: Tin; Military Standard: Not; Manufacturer URL: http://www.yageo.com/; Datasheet URL: http://www.yageo.com/documents/recent/PYu-RC_Group_51_RoHS_L_5.pdf; Height: 0.026inch; RoHSCompliant: true; Min Operating Temperature: -55degC; REACH SVHC: Unknown; Max Operating Temperature: 155degC; Depth: 1.6mm; Packaging: TapeandReel; Package Reference: 1206.0; Number of Terminations: 2; Case/Package: 1206; Composition: CarbonFilm; Case Code (Metric): 3216; Datasheet Version: Rev. 5, 10/2016; Power Rating: 250mW; Package Description: 2-Pin Surface Mount Device, Body 3.1 x 1.6 mm; Width: 0.063inch
F1 = CMP-2100-03653-1: PTC Resettable Fuse, 15 V, 500 mA, -40 to 85 degC, 2-Pin SMD, RoHS, Tape and Reel; Manufacturer: Bourns; Voltage Rating (DC): 15V; Max Current Rating: 100A; Power Dissipation: 800mW; Resistance: 150mOhm; Width: 3.41mm; Package Quantity: 2000; Voltage Rating: 15V; RoHSCompliant: true; Contact Plating: Gold; REACH SVHC: NoSVHC; Datasheet URL: http://www.bourns.com/docs/Product-Datasheets/mfmsmf.pdf; Lead Free: LeadFree; Height: 0.85mm; Min Operating Temperature: -40degC; Case Code (Metric): 4532; Number of Terminals: 2; Case Code (Imperial): 1812; Case/Package: 1812; Current Rating: 100A; Length: 4.73mm; Max Operating Temperature: 85degC; Package Reference: MF-MSMF050-2; Radiation Hardening: No; Datasheet Version: Rev. AG, 08/2016; Packaging: TapeandReel; Termination: SMD/SMT; Supply Voltage: 15V; Manufacturer URL: http://www.bourns.com/; Mount: SurfaceMount; Package Description: 2-Pin Surface Mount Device, Body 4.55 x 3.24 mm
FB1 = CMP-0686-00620-2: Chip Ferrite Bead for Power Lines, 30 Ohm, 4000 mA, -55 to 125 degC, 2 x 1.25 x 1.05 mm SMD, Tape and Reel; Manufacturer: Murata; DC Resistance: 0.014 Ohm Max.; Rated Current: 4000 mA; Impedance (at 100 MHz): 30 Ohm Typ.; ComponentLink3Description: Package Specification; Packing: Tape and Reel; ComponentLink3URL: http://www.murata.com/products/catalog/pdf/c31e.pdf; PackageDescription: 2-Pin Chip, Body 2 x 1.25 mm; DatasheetVersion: 08/2013; ComponentLink2Description: Datasheet; ComponentLink1Description: Manufacturer URL; PartNumber: BLM21PG300SN1D; PackageReference: BLM21_H1050-2; Mounting Technology: Surface Mount; ComponentLink1URL: http://www.murata.com/; Operating Temperature Range: -55 to 125 degC; ComponentLink2URL: http://www.murata.com/products/catalog/pdf/c31e.pdf
IC1 = CMP-0244-00311-1: Low-dropout linear regulator 5V -LM1117IMPX-5.0 / Fixed Low Drop Positive Voltage Regulator, 5V, 4-Pin SOT-223, Tape and Reel; PackageReference: SOT-223; PackageVersion: 2010; ComponentLink2URL: http://www.st.com/internet/com/TECHNICAL_RESOURCES/TECHNICAL_LITERATURE/DATASHEET/CD00000544.pdf; ComponentLink1URL: http://www.st.com; ComponentLink2Description: Datasheet; DatasheetVersion: 1/11/2011; ComponentLink1Description: Manufacturer URL; PackageDescription: 4-Pin SOT-223 Package, 6.5 x 3.5 mm Body, 2.3 mm Pitch, 7 mm Lead Span
IC2 = CMP-0095-00210-2: 8-bit AVR Microcontroller, 4.5-5.5V, 16MHz, 256KB Flash, 4KB EEPROM, 8KB SRAM, 86 GPIO pins, 100-pin TQFP, Industrial Grade (-40°C to 85°C), Pb-Free; PackageDescription: 100-Pin Thin Profile Plastic Quad Flat Pack (TQFP), 14 x 14 x 1.0 mm Body, 0.5 mm Pitch; ComponentLink1Description: Manufacturer URL; ComponentLink3URL: http://www.atmel.com/dyn/resources/prod_documents/2549S.pdf; RevisionNote: DatasheetVersion & PackageVersion updated. URLs added.; DatasheetVersion: revN, May-2011; ComponentLink2Description: ATmega640/1280/1281/2560/2561 Datasheet; PackageReference: 100A; PackageVersion: revD, Oct-2010; Code_JEDEC: MS-026-AED; ComponentLink1URL: http://www.atmel.com/; ComponentLink2URL: http://www.atmel.com/dyn/resources/prod_documents/doc2549.pdf; ComponentLink3Description: ATmega640/1280/1281/2560/2561 Summary
IC3 = CMP-0758-00080-2: Single Output Low Noise LDO, 150 mA, Fixed 3.3 V Output, 1.5% Tolerance, 2.2 to 16 V Input, Low IQ, 5-Pin SOT-23 (DBV), -40 to 125 degC, Green (RoHS & no Sb/Br), Tape and Reel; Manufacturer: Texas Instruments; Vdo (Typ) (mV): 280; Accuracy (%): 1.5; Output Options: Fixed Output; Fixed Output Options (V): 3.3; Iout (Max) (A): 0.15; Iq (Typ) (mA): 0.85; ComponentLink3Description: Package Specification; Packing: Tape and Reel; ComponentLink3URL: http://www.ti.com/litv/pdf/mpds018j; Vin (V): 2.2 to 16; Mounting Technology: Surface Mount; ComponentLink1URL: http://www.ti.com/; PartNumber: LP2985-33DBVR; PackageReference: DBV0005A; ComponentLink2URL: http://www.ti.com/lit/ds/symlink/lp2985-50.pdf; RoHS: TRUE; ComponentLink2Description: Datasheet; PackageVersion: 4073253-4/L; Operating Temperature Range (degC): -40 to 125; DatasheetVersion: SLVS522N; ComponentLink1Description: Manufacturer URL; PackageDescription: 5-Pin Plastic Small Outline, Body 2.9 x 1.6 mm, Pitch 0.95 mm
IC4 = CMP-0095-00115-3: 8-bit AVR Microcontroller, 2.7-5.5V, 16KB Flash, 512 Bytes EEPROM, 512 Bytes SRAM, 32-pin VQFN, Industrial Grade (-40°C to 85°C); ComponentLink1Description: Manufacturer URL; RevisionNote: Schematic symbol corrected; ComponentLink3URL: http://www.atmel.com/dyn/resources/prod_documents/7799S.pdf; ComponentLink2URL: http://www.atmel.com/dyn/resources/prod_documents/doc7799.pdf; PackageReference: 32PG; DatasheetVersion: revD, Nov-2010; PartNumber: ATmega16U2-MU; PackageVersion: revA, Oct-2008; Code_JEDEC: MO-220WHHD-2; PackageDescription: 32-Pin Quad Flat No-Lead (QFN) Sawn,  5 x 5 x 1.0 mm Body, Pitch 0.50 mm, 3.60mm Exposed Pad; ComponentLink2Description: ATmega8U2/16U2/32U2 Datasheet; ComponentLink1URL: http://www.atmel.com/; ComponentLink3Description: ATmega8U2/16U2/32U2 Summary
J1 J3 = CMP-2000-05246-1: Micro-USB B Receptacle with Flange, -30 to 85 degC, 5-Pin SMD, RoHS, Tape and Reel; Manufacturer: Molex; Number of Contacts: 5; Body Orientation: RightAngle; Maximum Voltage Rating: 30VAC; Pitch: 0.65mm; Maximum Current Rating: 1.8/ContactA; Number of Ports: 1; Gender: RCP; Operating Temperature: -30to85C; Part No: 47346-0001; Color: Black; Termination Method: Solder; Contact Plating: GoldOverPalladiumNickelOverNickel; Dimension: 7.8x5.43x2.94mm; Number of Terminals: 5; Datasheet Version: Dec-13; Datasheet URL: https://datasheet.ciiva.com/30075/304740473460001-io-nectors-30075527.pdf; Contact Material: CopperAlloy; RoHS: Yes; Housing Material: LiquidCrystalPolymer; Manufacturer URL: http://www.molex.com/; Packaging: EmbossedTapeandReel; Mounting: SurfaceMount; Type: MicroUSBTypeB
J2 J4 = CMP-1502-03213-1: USB 3.1 Type C Receptacle WR-COM, Horizontal, SMT / THT; Manufacturer: Wurth Elektronik; Working Voltage: 20VDC; Rated Current: 5A; Contact Resistance: 30mOhm; Operating Temperature: -40to105degC; Publisher: WurthElektronik; Gender: Receptacle; Part Number: 632723100011; Mounting Technology: SMT/THT; Datasheet URL: https://katalog.we-online.de/em/datasheet/632723x00011%282%29.pdf; Connector Type: USB3.1TypeC; Manufacturer URL: https://item.szlcsc.com/292999.html; Orientation: Horizontal; Package Reference: 632723100011; Packaging: TapeandReel
JTAG = Header 4: Header, 4-Pin; LatestRevisionDate: 17-Jul-2002; LatestRevisionNote: Re-released for DXP Platform.; Publisher: Altium Limited
L1 = 0603 10uH 10%: 贴片电感; ComponentLink1Description: 供应商链接; ComponentLink1URL: http://www.szlcsc.com/product/details_1387.html; Package: 0603; Supplier: LC; SuppliersPartNumber: C1035
L2 RX1 TX1 = 0603 黄灯: 发光二极管; ComponentLink1Description: 供应商链接; ComponentLink1URL: http://www.szlcsc.com/product/details_73147.html; Package: 0603; Supplier: LC; SuppliersPartNumber: C72038
M1 M2 = CMP-2100-03693-1: Toshiba Bi-CD Integrated Circuit Silicon Monolithicr, 2.7 to 5.5 V, 1 A, -20 to 85 degC, 24-Pin SSOP, RoHS, Tape and Reel; Package Reference: SSOP24-P-300-0.65A; Manufacturer URL: http://www.toshiba.com/; Datasheet URL: https://toshiba.semicon-storage.com/info/docget.jsp?did=10660&prodName=TB6612FNG; Manufacturer: Toshiba; Package Description: 24-Pin Shrink Small Outline Package Integrated Circuit, Body 7.8 x 5.6 mm, Pitch 0.65 mm; Datasheet Version: 41913.0
ON1 = 0805 翠绿: 发光二极管; ComponentLink1Description: 供应商链接; ComponentLink1URL: http://www.szlcsc.com/product/details_2670.html; Package: 0805; Supplier: LC; SuppliersPartNumber: C2297
P1 P2 TEST_HEADER UART = Header 3X2: Header, 3-Pin, Dual row; LatestRevisionDate: 17-Jul-2002; LatestRevisionNote: Re-released for DXP Platform.; Publisher: Altium Limited
P3 = CMP-2000-05163-1: Male Header, Pitch 2 mm, 1 x 2 Position, Height 6.6 mm, RoHS, Tape and Reel; Manufacturer: JST; No of Positions: 2; Style/Orientation: StraightHeader/Plug; Pitch: 2mm; Datasheet URL: https://ciiva.com/datasheet-click-26894756?src=ciiva&sig=90099765; Termination: Crimp; Manufacturer URL: http://www.jst.com/home2.html; Type: ShroudedHeader; Datasheet Version: Dec-12
P4 = CMP-2000-05163-1: Male Header, Pitch 2 mm, 1 x 2 Position, Height 6.6 mm, RoHS, Tape and Reel / B2B-PH-SM4-TB(LF)(SN); Manufacturer: JST; No of Positions: 2; Style/Orientation: StraightHeader/Plug; Pitch: 2mm; Datasheet URL: https://ciiva.com/datasheet-click-26894756?src=ciiva&sig=90099765; Termination: Crimp; Manufacturer URL: http://www.jst.com/home2.html; Type: ShroudedHeader; Datasheet Version: Dec-12
P5 = CMP-2000-07027-1: Male Header, Pitch 2 mm, 1 x 6 Position, Height 5.5 mm, -25 to 85 degC / S6B-PH-SM4-TB(LF)(SN); Manufacturer: JST; Pitch: 2mm; Style/Orientation: RightAngleHeader/Plug; No of Positions: 6; Package Reference: S6B-PH-SM4-TB(LF)(SN); Type: ShroudedHeader; Package Description: Male Header, Pitch 2 mm, 1 x 6 Position, Height 5.5 mm; Mounting Technology: SurfaceMount; Datasheet Version: 11/2008; Termination: Solder; Datasheet URL: https://datasheet.ciiva.com/11747/0900766b80df0d9d-11747278.pdf; Manufacturer URL: http://www.jst.com/home2.html
P6 = CMP-2000-07078-1: Male Header, Pitch 2 mm, 1 x 4 Position, Height 5.7 mm, -25 to 85 degC, RoHS, Tape and Reel; Manufacturer: Japan Solderless Terminals; Pitch: 2mm; No of Positions: 4; Style/Orientation: RightAngleHeader/Plug; Termination: Crimp; Datasheet URL: http://www.jst-mfg.com/product/pdf/eng/ePA-F.pdf; Datasheet Version: 03/2012; Mounting Technology: SurfaceMount; Package Reference: SM04B-PASS-TBT(LF)(SN); Manufacturer URL: http://www.jst-mfg.com/index_e.php; Type: WiretoBoard; Package Description: Male Header, Pitch 2 mm, 1 x 4 Position, Height 5.7 mm
P8-P11 = CMP-1755-00001-1: Male Header, Pitch 2 mm, 1 x 2 Position, Height 5.5 mm, -25 to 85 degC, RoHS, Tape and Reel; Current Rating: 3 A; ComponentLink1URL: http://www.jst.com/home2.html; Radiation Hardening: No; RoHSCompliant: True; Mount: Through Hole; Contact Material: Bronze; Package Quantity: 100; Width: 2.34 mm; DatasheetVersion: Dec-12; Height: 8.13 mm; Max Operating Temperature: 105degC; ComponentLink2Description: Datasheet; Lead Pitch: 0.1 inch; Contact Finish: Lead; Packaging: Bulk; Colour: Black; Contact Plating: Tin; Min Operating Temperature: -65degC; ComponentLink1Description: Manufacturer URL; PackageReference: S2B-PH-SM4-TB(LF)(SN)-2; PackageDescription: Male Header, Pitch 2 mm, 1 x 2 Position, Height 5.5 mm; ComponentLink2URL: http://www.jst-mfg.com/product/pdf/eng/ePH.pdf; Pins: 40; Length: 101.19 mm
Q1 = AO3401A P道沟 X13A15 SOT-23: MOS(场效应管); ComponentLink1Description: 供应商链接; ComponentLink1URL: http://www.szlcsc.com/product/details_15801.html; Package: SOT-23; Supplier: LC; SuppliersPartNumber: C15127
Q2 Q3 = CMP-1048-00631-1: General Purpose Transistor, NPN Silicon, 3-Pin SOT-23, Pb-Free, Tape and Reel / MMBT3904LT1G; Manufacturer: On Semiconductor; IC Continuous (A): 0.2; fT Min (MHz): 300; ComponentLink2Description: Datasheet; Polarity: NPN; PackageDescription: 3-Pin Small Outline Transistor, Body 2.92 x 1.3 mm, Pitch 0.95 mm; ComponentLink2URL: http://www.onsemi.cn/pub_link/Collateral/MMBT3904LT1-D.PDF; DatasheetVersion: Rev. 12; Mounting Technology: Surface Mount; PartNumber: MMBT3904LT1G; ComponentLink1URL: http://www.onsemi.com/; ComponentLink3Description: Package Specification; ComponentLink1Description: Manufacturer URL; PackageVersion: Rev. AP, 11/2009; PackageReference: SOT-23-3-318-08; Packing: Tape and Reel; ComponentLink3URL: http://www.onsemi.cn/pub_link/Collateral/318-08.PDF; RoHS: TRUE
R1 R2 = 0603 22Ω (22R0) 1%: 贴片电阻; ComponentLink1Description: 供应商链接; ComponentLink1URL: http://www.szlcsc.com/product/details_24078.html; Package: 0603; Supplier: LC; SuppliersPartNumber: C23345
R3 R6 R13 R18 R19 = 0603 1KΩ (1001) 1%: 贴片电阻; ComponentLink1Description: 供应商链接; ComponentLink1URL: http://www.szlcsc.com/product/details_21904.html; Package: 0603; Supplier: LC; SuppliersPartNumber: C21190
R4 R5 R7 R8 R10 R11 R14 = 0603 10KΩ (1002) 1%: 贴片电阻; ComponentLink1Description: 供应商链接; ComponentLink1URL: http://www.szlcsc.com/product/details_26547.html; Package: 0603; Supplier: LC; SuppliersPartNumber: C25804
R9 R12 = 0603 1MΩ (1004) 1%: 贴片电阻; ComponentLink1Description: 供应商链接; ComponentLink1URL: http://www.szlcsc.com/product/details_23662.html; Package: 0603; Supplier: LC; SuppliersPartNumber: C22935
R15 = 0603 22KΩ (2202) 1%: 贴片电阻; ComponentLink1Description: 供应商链接; ComponentLink1URL: http://www.szlcsc.com/product/details_32812.html; Package: 0603; Supplier: LC; SuppliersPartNumber: C31850
R16 = 0603 47KΩ (4702) 1%: 贴片电阻; ComponentLink1Description: 供应商链接; ComponentLink1URL: http://www.szlcsc.com/product/details_26562.html; Package: 0603; Supplier: LC; SuppliersPartNumber: C25819
R17 = 0603 4.7KΩ (4701) 1%: 贴片电阻; ComponentLink1Description: 供应商链接; ComponentLink1URL: http://www.szlcsc.com/product/details_23889.html; Package: 0603; Supplier: LC; SuppliersPartNumber: C23162
R?#1 R?#2 = 0603 39KΩ (3902) 1%: 贴片电阻; ComponentLink1Description: 供应商链接; ComponentLink1URL: http://www.szlcsc.com/product/details_23880.html; Package: 0603; Supplier: LC; SuppliersPartNumber: C23153
RA = 0603 15KΩ (1502) 1%: 贴片电阻; ComponentLink1Description: 供应商链接; ComponentLink1URL: http://www.szlcsc.com/product/details_23536.html; Package: 0603; Supplier: LC; SuppliersPartNumber: C22809
RB = 0603 100KΩ (1003) 1%: 贴片电阻; ComponentLink1Description: 供应商链接; ComponentLink1URL: http://www.szlcsc.com/product/details_26546.html; Package: 0603; Supplier: LC; SuppliersPartNumber: C25803
RESET1 = CMP-1452-00002-1: WS-TASV SMD Tact Switch 6X6 mm; Manufacturer: Wuerth Elektronik; NoPins: 04; PartNumber: 430152043836; ComponentLink2URL: http://katalog.we-online.de/em/datasheet/4301x2.pdf; ComponentLink1URL: http://www.we-online.com; ComponentLink2Description: Datasheet; ComponentLink1Description: Manufacturer URL; PackageReference: 430152043836
Rp1 Rp3 = 0603*4  1KΩ (102) 5%: 贴片排阻; ComponentLink1Description: 供应商链接; ComponentLink1URL: http://www.szlcsc.com/product/details_20907.html; Package: 0603*4; Supplier: LC; SuppliersPartNumber: C20197
Rp2 = 0603*4 470Ω (471) 5%: 贴片排阻; ComponentLink1Description: 供应商链接; ComponentLink1URL: http://www.szlcsc.com/product/details_26253.html; Package: 0603*4; Supplier: LC; SuppliersPartNumber: C25510
SW1 SW2 SW? = CMP-2000-07511-1: FSMSM Push Button Switch, 50 mA, -35 to 85 degC, 2-Pin SMD, RoHS, Bulk; Manufacturer: TE Connectivity; Actuator Length: 1.07mm; Electrical Life: 20000Cycles; Actuator Material: Polyamide; Current Rating: 50mA; Illumination Type: Illuminated; Voltage Rating (DC): 24V; Contact Resistance: 100mOhm; Case\/Package: SMD/SMT; Operating Force: 180gf; Switch Travel: 0.25mm; Max Voltage Rating (DC): 12V; Throw Configuration: SPST; Packaging: LoosePiece; Max Operating Temperature: 85degC; ELV: Compliant; Package Description: 2-Pin Surface Mount Device, Body 6 x 3.5 mm, Pitch 9.19 mm; RoHSCompliant: true; Manufacturer URL: http://www.te.com/; Contact Plating: Silver; Contact Material: Brass; Mounting Technology: SurfaceMount; Contact Current Rating: 50mA; Datasheet Version: Rev. C2, 08/2014; Datasheet URL: http://www.te.com/commerce/DocumentDelivery/DDEController?Action=showdoc&DocId=Customer+Drawing%7F1437566-3%7FC2%7Fpdf%7FEnglish%7FENG_CD_1437566-3_C2_1437566_3_1_c.dwg.pdf%7F1437566-3; Mechanical Life: 20000Cycles; Package Reference: FSMSM; REACH SVHC: Unknown; Orientation: Straight; Min Operating Temperature: -35degC; Lead Free: LeadFree; Termination: GullWing; Package Quantity: 1000; Mount: SurfaceMount
U1 = LM358DR2G_[C7950]: 通用运放; ComponentLink1Description: 供应商链接; ComponentLink1URL: http://www.szlcsc.com/product/details_8427.html; Package: SOIC-8; Supplier: LC; SuppliersPartNumber: C7950
U2-U10 = CMP-2000-05026-1: Intelligent Control LED Integrated Light Source, 3.5 to 5.3 V, -25 to 80 degC, 4-Pin SMD, RoHS, Tape and Reel / 1655; Manufacturer: Adafruit-Industries-LLC; Number of LEDs: 10; Configuration: Discrete; Utilized LED: WS2812(5050); Datasheet URL: http://datasheet.octopart.com/ADA1655-Adafruit-Industries-datasheet-32028139.pdf; Series: Neopixel; Interface: -; Package Description: 4-Pin Surface Mount Device, Body 5 x 5 mm; Color: Red,Green,Blue(RGB); Category: Optoelectronics; Controller Type: -; Package Reference: 1655; Manufacturer URL: https://www.adafruit.com/; Mounting Type: SurfaceMount; Datasheet Version: May-13; Size / Dimension: 5.00mmLx5.00mmW; Family: Addressable,Specialty
U11 = CMP-2000-07454-1: Espressif System, 2.7 to 3.6 V, -40 to 85 degC, 38-Pin SMD; Manufacturer: Olimex; Package Description: 38-Pin Surface Mount Device, Body 18 x 25.5 mm, Pitch 1.27 mm; Manufacturer URL: https://www.olimex.com; RoHSCompliant: false; Mounting Technology: SurfaceMount; Datasheet Version: Rev. 2.1, 09/2017; Datasheet URL: http://www.espressif.com/sites/default/files/documentation/esp-wroom-32_datasheet_en.pdf; Package Reference: ESP-WROOM-32
U12 = CMP-0009-00001-1: XBee ZB SMT RF Module, 2.4 GHz, 250 kbps, -100 dBm, 2.1 to 3.6 V, 28 mA, 3.1 mW, -40 to 85 degC, 37-Pin Module, RoHS; Manufacturer: Digi international; Operating Current (Receive): 28 mA; Transmit Power Output: 3.1 mW; Indoor/Urban Range: Up to 200 ft. (60 m); RF Data Rate: 250000 bps; Operating Frequency Band: ISM 2.4 to 2.5 GHz; Outdoor RF line-of-sight Range: Up to 4000 ft. (1200 m); Operating Temperature: -40 to 85 degC; Supply Voltage: 2.1 to 3.6 V; ComponentLink3URL: http://ftp1.digi.com/support/documentation/90002002_K.pdf; ROHS: TRUE; PackageDescription: 37-Pin Module, Body 21.996 x 33.782 mm, Pitch 2.007 mm; PackageReference: XB24CZ7RIS-004-Module-37; DatasheetVersion: Sep-13; ComponentLink3Description: Package Specification; Receiver Sensitivity: -100 dBm; ComponentLink2URL: http://ftp1.digi.com/support/documentation/90002002_K.pdf; PartNumber: XB24CZ7RIS-004; Mounting Technology: Surface Mount; ComponentLink1Description: Manufacturer URL; ComponentLink2Description: Datasheet; PackageVersion: 6/9/2013; ComponentLink1URL: http://www.digi.com/
U13 U14 = CMP-2000-05192-1: Diode Array, 6 V, 10 A, -40 to 125 degC, 6-Pin SOT-23, RoHS, Tape and Reel; Polarity: Bidirectional; Brand: Littelfuse; Clamping Voltage: 15V; Peak Surge Current: 10A; Working Voltage: 6V; Pd - Power Dissipation: 150W; Number of Channels: 4Channel; Mounting Style: SMD/SMT; Termination Style: SMD/SMT; Datasheet Version: May-15; Height: 1.45mm; Manufacturer: Littelfuse; Manufacturer URL: http://www.littelfuse.com/; Package URL: http://www.vishay.com/docs/28729/28729.pdf; RoHS: True; Package Reference: SOT23-6; Type: TVSDiodeArraysLowCapacitanceESDProtection; Product Category: TVSDiodeArrays; Datasheet URL: http://www.littelfuse.com/~/media/electronics/datasheets/tvs_diode_arrays/littelfuse_tvs_diode_array_srv05_datasheet.pdf.pdf; Package / Case: SOT-23-6; Minimum Operating Temperature: -40C; Maximum Operating Temperature: +85C; Width: 3mm; Package Description: 6-Pin Small Outline Transistor, Body 2.9 x 1.625 mm, Pitch 0.95 mm; Length: 3mm; Series: SRV05; Packaging: Reel
U15 = CMP-1005-00005-1: System-In-Package Integrating Microstepping Controller and 10 A Power MOSFET, 7.5 to 85 V, -40 to 150 degC, 102-Pin QFN (VFQFN), RoHS, Tray; Manufacturer: STMicroelectronics; Iboot: 2.6 mA Typ.; RpumpHS: 10 Ohm Typ.; RDS(on)@125 degC: 23 MOhm Typ.; RoHS: TRUE; ComponentLink2Description: Datasheet; Temperature Range: -40 to 150 degC; Packing: Tray; Operating Voltage: 7.5 to 85 V; ComponentLink2URL: http://www.st.com/st-web-ui/static/active/en/resource/technical/document/datasheet/DM00090983.pdf; Mounting Technology: Surface Mount; ComponentLink3Description: Package Specification; PartNumber: POWERSTEP01; PackageDescription: 102-Pin Quad Flat Non-Leaded Package, Body 11 x 14 mm; ComponentLink3URL: http://www.st.com/st-web-ui/static/active/en/resource/technical/document/datasheet/DM00090983.pdf; ComponentLink1Description: Manufacturer URL; DatasheetVersion: Rev. 4; ComponentLink1URL: www.st.com
X1 = Header 2: Header, 2-Pin; LatestRevisionDate: 17-Jul-2002; LatestRevisionNote: Re-released for DXP Platform.; Publisher: Altium Limited
Y1 = SMD-3225_4P  16MHZ 9PF 10PPM: 贴片晶振; ComponentLink1Description: 供应商链接; ComponentLink1URL: http://www.szlcsc.com/product/details_14393.html; Package: SMD-3225_4P; Supplier: LC; SuppliersPartNumber: C13738
Y2 = CMP-0588-00001-2: Ceramic Resonator, 16 MHz with Built-in Capacitance, Thickness Expander Mode, Initial Frequency Tolerance +/- 0.5%, Load Capacity 15 pF, -20 to 80 degC, 3.2 x 1.3 x 1 mm SMD, RoHS, Reel; Manufacturer: Murata; Oscillating Frequency: 16 MHz; Load Capacity: 15 pF; PackageDescription: 3-Pin SMD, Body 3.2 x 1.3 mm, Pitch 0.95 mm; Mounting Technology: Surface Mount; ComponentLink1URL: http://www.murata.com/; RoHS: TRUE; Packing: Reel; Initial Frequency Tolerance: +/- 0.5%; PartNumber: CSTCE16M0V53-R0; ComponentLink2Description: Datasheet; DatasheetVersion: Rev. P16E-22; PackageReference: CSTCE_V-3; Operating Temperature Range: -20 to 80 degC; ComponentLink2URL: http://www.murata.com/products/catalog/pdf/p16e.pdf; ComponentLink1Description: Manufacturer URL; Initial Tolerance: +/- 0.5%
Z1 Z2 = CMP-0584-00001-2: ESD Protector, 5 V Supply, -40 to 85 degC, 1.6 x 0.8 x 0.55 mm SMD, RoHS, Tape and Reel; Manufacturer: Bourns; VC: 20 V; VT: 150 V; RT: 1 ns; VDC: 5 V; CO: 0.5 pF; PartNumber: CG0603MLC-05E; ComponentLink1Description: Manufacturer URL; ComponentLink1URL: http://www.bourns.com/; Packing: Tape and Reel; Mounting Technology: Surface Mount; ComponentLink2Description: Datasheet; RoHS: TRUE; Operating Temperature: -40 to 85 degC; DatasheetVersion: Rev. S; PackageDescription: 2-Pin SMD, Body 1.6 x 0.8 mm, Pitch 1.52 mm; PackageReference: CG0603-2; ComponentLink2URL: http://www.bourns.com/data/global/pdfs/MLC.pdf